# EAGLE design BMW_testboard (EAGLE 6.4)
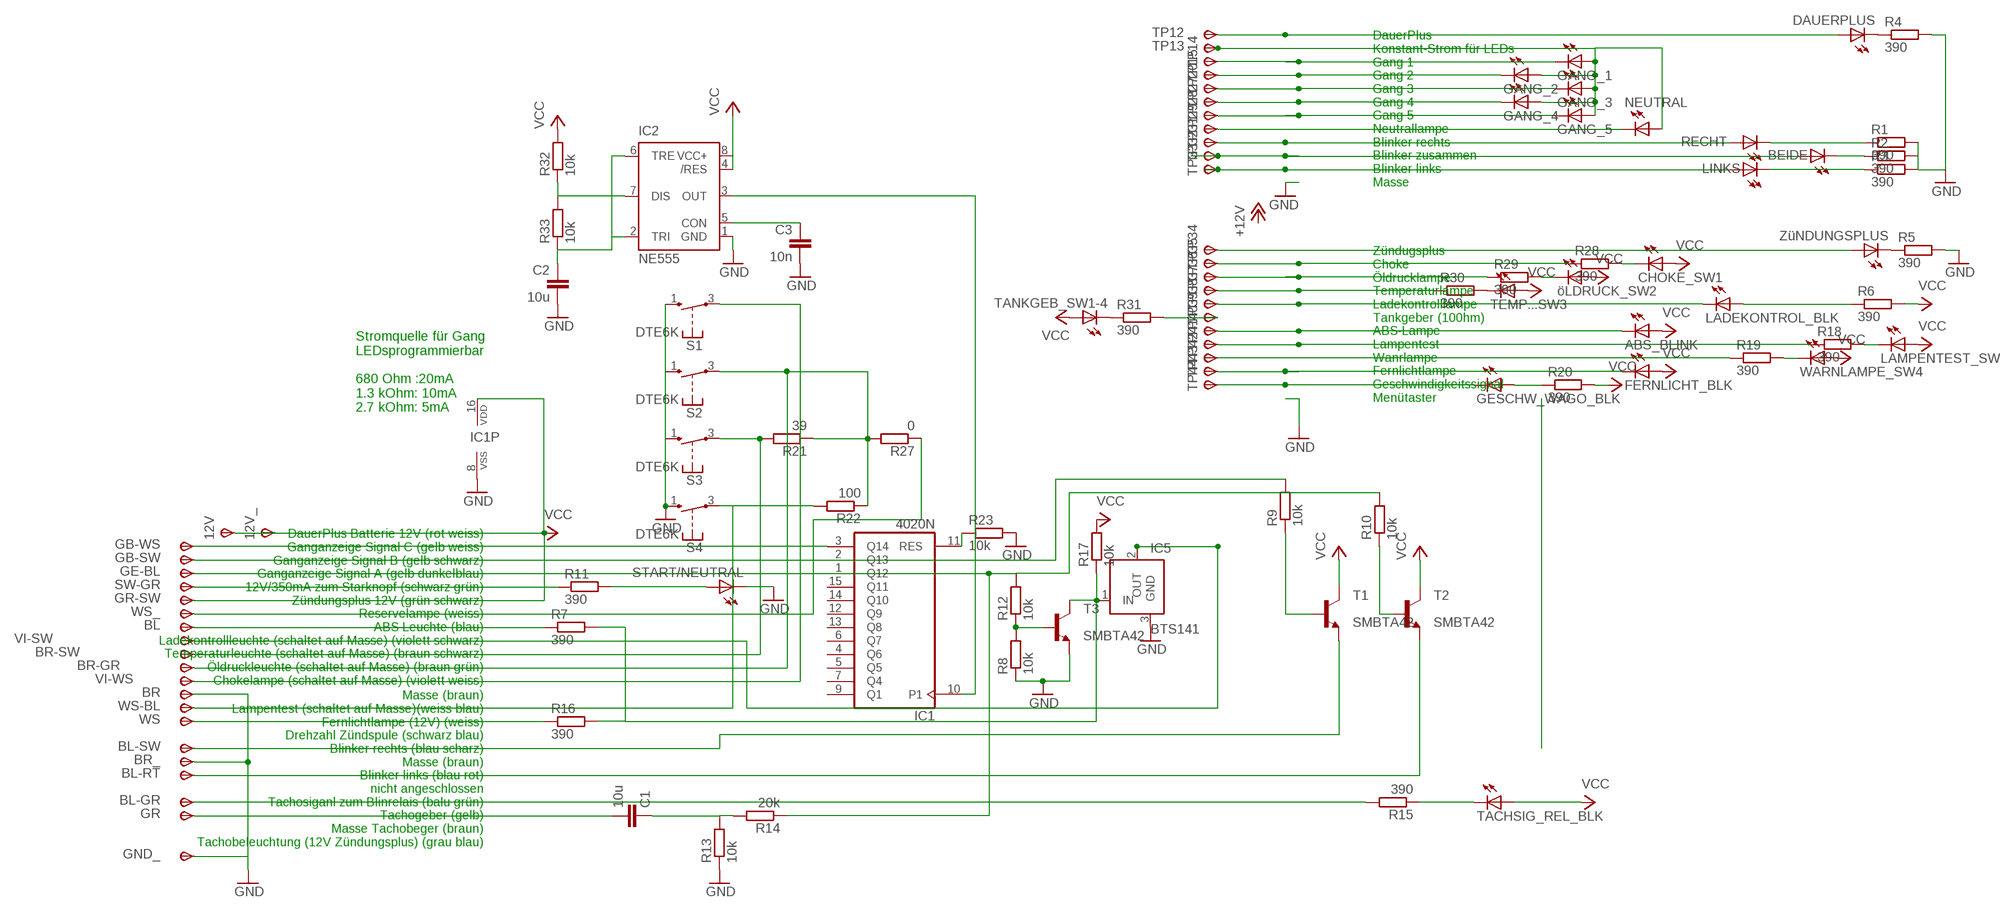
[diagram p0: schematic, sheet 1]

## Parts
12V  TPSPAD1-1.5MM  [P1-13]
12V_  TPSPAD1-1.5MM  [P1-13]
ABS_BLINK  TLLY4400  [LED3MM]
BEIDE  TLLY4400  [LED3MM]
BL  TPSPAD1-1.5MM  [P1-13]
BL-GR  TPSPAD1-1.5MM  [P1-13]
BL-RT  TPSPAD1-1.5MM  [P1-13]
BL-SW  TPSPAD1-1.5MM  [P1-13]
BR  TPSPAD1-1.5MM  [P1-13]
BR-GR  TPSPAD1-1.5MM  [P1-13]
BR-SW  TPSPAD1-1.5MM  [P1-13]
BR_  TPSPAD1-1.5MM  [P1-13]
C1  10u  C-EU025-024X044  [C025-024X044]
C2  10u  C-EU025-024X044  [C025-024X044]
C3  10n  C-EU025-024X044  [C025-024X044]
CHOKE_SW1  TLLY4400  [LED3MM]
DAUERPLUS  TLLY4400  [LED3MM]
FERNLICHT_BLK  TLLY4400  [LED3MM]
GANG_1  TLLY4400  [LED3MM]
GANG_2  TLLY4400  [LED3MM]
GANG_3  TLLY4400  [LED3MM]
GANG_4  TLLY4400  [LED3MM]
GANG_5  TLLY4400  [LED3MM]
GB-SW  TPSPAD1-1.5MM  [P1-13]
GB-WS  TPSPAD1-1.5MM  [P1-13]
GE-BL  TPSPAD1-1.5MM  [P1-13]
GESCHW_WAGO_BLK  TLLY4400  [LED3MM]
GND_  TPSPAD1-1.5MM  [P1-13]
GR  TPSPAD1-1.5MM  [P1-13]
GR-SW  TPSPAD1-1.5MM  [P1-13]
IC1  4020N  [DIL16]
IC2  NE555  [DIL-08]
IC5  BTS141  [TO220-3-45]
LADEKONTROL_BLK  TLLY4400  [LED3MM]
LAMPENTEST_SW4  TLLY4400  [LED3MM]
LINKS  TLLY4400  [LED3MM]
NEUTRAL  TLLY4400  [LED3MM]
R1  390  R-EU_R0805  [R0805]
R2  390  R-EU_R0805  [R0805]
R3  390  R-EU_R0805  [R0805]
R4  390  R-EU_R0805  [R0805]
R5  390  R-EU_R0805  [R0805]
R6  390  R-EU_R0805  [R0805]
R7  390  R-EU_R0805  [R0805]
R8  10k  R-EU_R0805  [R0805]
R9  10k  R-EU_R0805  [R0805]
R10  10k  R-EU_R0805  [R0805]
R11  390  R-EU_R0805  [R0805]
R12  10k  R-EU_R0805  [R0805]
R13  10k  R-EU_0207/12  [0207/12]
R14  20k  R-EU_0207/12  [0207/12]
R15  390  R-EU_R0805  [R0805]
R16  390  R-EU_R0805  [R0805]
R17  10k  R-EU_R0805  [R0805]
R18  390  R-EU_R0805  [R0805]
R19  390  R-EU_R0805  [R0805]
R20  390  R-EU_R0805  [R0805]
R21  39  R-EU_0207/12  [0207/12]
R22  100  R-EU_0207/12  [0207/12]
R23  10k  R-EU_R0805  [R0805]
R27  0  R-EU_0207/12  [0207/12]
R28  390  R-EU_R0805  [R0805]
R29  390  R-EU_R0805  [R0805]
R30  390  R-EU_R0805  [R0805]
R31  390  R-EU_R0805  [R0805]
R32  10k  R-EU_0207/12  [0207/12]
R33  10k  R-EU_0207/15  [0207/15]
RECHT  TLLY4400  [LED3MM]
S1  DTE6K  [DTE6K]
S2  DTE6K  [DTE6K]
S3  DTE6K  [DTE6K]
S4  DTE6K  [DTE6K]
START/NEUTRAL  TLLY4400  [LED3MM]
SW-GR  TPSPAD1-1.5MM  [P1-13]
T1  MMBTA42LT1-NPN-SOT23-BEC  [SOT23-BEC]
T2  MMBTA42LT1-NPN-SOT23-BEC  [SOT23-BEC]
T3  MMBTA42LT1-NPN-SOT23-BEC  [SOT23-BEC]
TACHSIG_REL_BLK  TLLY4400  [LED3MM]
TANKGEB_SW1-4  TLLY4400  [LED3MM]
TEMP...SW3  TLLY4400  [LED3MM]
TP12  TPSPAD1-1.5MM  [P1-13]
TP13  TPSPAD1-1.5MM  [P1-13]
TP14  TPSPAD1-1.5MM  [P1-13]
TP15  TPSPAD1-1.5MM  [P1-13]
TP20  TPSPAD1-1.5MM  [P1-13]
TP27  TPSPAD1-1.5MM  [P1-13]
TP28  TPSPAD1-1.5MM  [P1-13]
TP29  TPSPAD1-1.5MM  [P1-13]
TP31  TPSPAD1-1.5MM  [P1-13]
TP32  TPSPAD1-1.5MM  [P1-13]
TP33  TPSPAD1-1.5MM  [P1-13]
TP34  TPSPAD1-1.5MM  [P1-13]
TP35  TPSPAD1-1.5MM  [P1-13]
TP36  TPSPAD1-1.5MM  [P1-13]
TP37  TPSPAD1-1.5MM  [P1-13]
TP38  TPSPAD1-1.5MM  [P1-13]
TP39  TPSPAD1-1.5MM  [P1-13]
TP40  TPSPAD1-1.5MM  [P1-13]
TP41  TPSPAD1-1.5MM  [P1-13]
TP42  TPSPAD1-1.5MM  [P1-13]
TP43  TPSPAD1-1.5MM  [P1-13]
TP44  TPSPAD1-1.5MM  [P1-13]
VI-SW  TPSPAD1-1.5MM  [P1-13]
VI-WS  TPSPAD1-1.5MM  [P1-13]
WARNLAMPE_SW4  TLLY4400  [LED3MM]
WS  TPSPAD1-1.5MM  [P1-13]
WS-BL  TPSPAD1-1.5MM  [P1-13]
WS_  TPSPAD1-1.5MM  [P1-13]
ZüNDUNGSPLUS  TLLY4400  [LED3MM]
öLDRUCK_SW2  TLLY4400  [LED3MM]

## Nets
GND: BR.TP(PP) BR_.TP(PP) C2.2 C3.2 GND_.TP(PP) IC1.8(VSS) IC2.1(GND) IC5.3(GND) R1.2 R2.2 R3.2 R4.2 R5.2 R8.1 R13.1 R23.2 S1.1(S) S2.1(S) S3.1(S) S4.1(S) START/NEUTRAL.K(C) T3.E
N$1: R19.1 TP42.TP(PP)
N$2: R31.2 TP39.TP(PP)
N$3: GB-WS.TP(PP) IC1.3(Q14)
N$4: ABS_BLINK.K(C) TP40.TP(PP)
N$5: GB-SW.TP(PP) IC1.2(Q13) R9.2
N$7: TP34.TP(PP) ZüNDUNGSPLUS.A
N$8: IC1.11(RES) R23.1
N$12: R30.2 TEMP...SW3.K(C)
N$13: R29.1 TP36.TP(PP)
N$14: R30.1 TP37.TP(PP)
N$15: R19.2 WARNLAMPE_SW4.K(C)
N$18: R11.2 START/NEUTRAL.A
N$19: R18.1 TP41.TP(PP)
N$20: RECHT.A TP31.TP(PP)
N$21: LINKS.A TP33.TP(PP)
N$22: BEIDE.A TP32.TP(PP)
N$23: R11.1 SW-GR.TP(PP)
N$24: LAMPENTEST_SW4.K(C) R18.2
N$25: LADEKONTROL_BLK.A R6.1
N$26: GESCHW_WAGO_BLK.K(C) TP44.TP(PP)
N$27: R1.1 RECHT.K(C)
N$28: BEIDE.K(C) R2.1
N$29: LINKS.K(C) R3.1
N$30: DAUERPLUS.K(C) R4.1
N$31: GESCHW_WAGO_BLK.A R20.1
N$33: DAUERPLUS.A TP12.TP(PP)
N$34: R5.1 ZüNDUNGSPLUS.K(C)
N$35: FERNLICHT_BLK.K(C) TP43.TP(PP)
N$37: BL.TP(PP) R7.1
N$39: IC5.2(OUT) VI-SW.TP(PP)
N$40: R22.2 S4.3(P) WS-BL.TP(PP)
N$41: BR-GR.TP(PP) R21.1 R22.1 R27.2 S2.3(P)
N$42: R9.1 T1.B
N$43: R10.1 T2.B
N$44: BL-SW.TP(PP) T1.E
N$45: BL-RT.TP(PP) T2.E
N$46: R8.2 R12.1 T3.B
N$47: C1.2 GR.TP(PP)
N$48: C1.1 R13.2 R14.2
N$49: GE-BL.TP(PP) IC1.1(Q12) R10.2 R12.2 R14.1
N$50: R15.1 TACHSIG_REL_BLK.K(C)
N$51: BL-GR.TP(PP) R15.2
N$52: NEUTRAL.K(C) TP29.TP(PP)
N$53: R16.1 WS.TP(PP)
N$56: R28.1 TP35.TP(PP)
N$57: IC5.1(IN) R7.2 R16.2 R17.1 T3.C
N$58: BR-SW.TP(PP) R21.2 S3.3(P)
N$59: GANG_1.A GANG_2.A GANG_3.A GANG_4.A GANG_5.A NEUTRAL.A TP13.TP(PP)
N$60: R29.2 öLDRUCK_SW2.K(C)
N$62: CHOKE_SW1.K(C) R28.2
N$63: GANG_5.K(C) TP28.TP(PP)
N$65: R31.1 TANKGEB_SW1-4.K(C)
N$66: C2.1 IC2.2(TRI) IC2.6(TRE) R33.1
N$67: IC1.10(P1) IC2.3(OUT)
N$68: IC2.7(DIS) R32.1 R33.2
N$70: C3.1 IC2.5(CON)
N$93: GANG_3.K(C) TP20.TP(PP)
N$94: GANG_4.K(C) TP27.TP(PP)
N$98: GANG_2.K(C) TP15.TP(PP)
N$99: GANG_1.K(C) TP14.TP(PP)
N$102: LADEKONTROL_BLK.K(C) TP38.TP(PP)
VCC: 12V.TP(PP) 12V_.TP(PP) ABS_BLINK.A CHOKE_SW1.A FERNLICHT_BLK.A GR-SW.TP(PP) IC1.16(VDD) IC2.4(/RES) IC2.8(VCC+) LAMPENTEST_SW4.A R6.2 R17.2 R20.2 R32.2 T1.C T2.C TACHSIG_REL_BLK.A TANKGEB_SW1-4.A TEMP...SW3.A WARNLAMPE_SW4.A öLDRUCK_SW2.A
VI-WS: S1.3(P) VI-WS.TP(PP)
WS: R27.1 WS_.TP(PP)
Unconnected: IC1.4(Q6) IC1.5(Q5) IC1.6(Q7) IC1.7(Q4) IC1.9(Q1) IC1.12(Q9) IC1.13(Q8) IC1.14(Q10) IC1.15(Q11)

## Notes on the sheet
- DauerPlus
  Konstant-Strom für LEDs
  Gang 1
  Gang 2
  Gang 3
  Gang 4
  Gang 5
  Neutrallampe
  Blinker rechts
  Blinker zusammen
  Blinker links
  Masse
- Zündugsplus
  Choke
  Öldrucklampe
  Temperaturlampe
  Ladekontrolllampe
  Tankgeber (100hm)
  ABS-Lampe
  Lampentest
  Wanrlampe
  Fernlichtlampe
  Geschwindigkeitssignal
  Menütaster
- Stromquelle für Gang 
  LEDsprogrammierbar
  
  680 Ohm :20mA
  1.3 kOhm: 10mA
  2.7 kOhm: 5mA
- DauerPlus Batterie 12V (rot weiss)
  Ganganzeige Signal C (gelb weiss)
  Ganganzeige Signal B (gelb schwarz)
  Ganganzeige Signal A (gelb dunkelblau)
  12V/350mA zum Starknopf (schwarz grün)
  Zündungsplus 12V (grün schwarz)
  Reservelampe (weiss)
  ABS Leuchte (blau)
  Ladekontrollleuchte (schaltet auf Masse) (violett schwarz)
  Temperaturleuchte (schaltet auf Masse) (braun schwarz)
  Öldruckleuchte (schaltet auf Masse) (braun grün)
  Chokelampe (schaltet auf Masse) (violett weiss)
- Masse (braun)
  Lampentest (schaltet auf Masse)(weiss blau)
  Fernlichtlampe (12V) (weiss)
  Drehzahl Zündspule (schwarz blau)
  Blinker rechts (blau scharz)
  Masse (braun)
  Blinker links (blau rot)
  nicht angeschlossen
  Tachosiganl zum Blinrelais (balu grün)
  Tachogeber (gelb)
  Masse Tachobeger (braun)
  Tachobeleuchtung (12V Zündungsplus) (grau blau)

## Library data of the parts
12V 12V_ BL BL-GR BL-RT BL-SW BR BR-GR BR-SW BR_ GB-SW GB-WS GE-BL GND_ GR GR-SW SW-GR TP12-TP15 TP20 TP27-TP29 TP31-TP44 VI-SW VI-WS WS WS-BL WS_ = testpin_BMW:TPS: TEST PIN
ABS_BLINK BEIDE CHOKE_SW1 DAUERPLUS FERNLICHT_BLK GANG_1-GANG_5 GESCHW_WAGO_BLK LADEKONTROL_BLK LAMPENTEST_SW4 LINKS NEUTRAL RECHT START/NEUTRAL TACHSIG_REL_BLK TANKGEB_SW1-4 TEMP...SW3 WARNLAMPE_SW4 ZüNDUNGSPLUS öLDRUCK_SW2 = led:TLLY4400: Low Current (2mA) LED 3 mm Tinted Diffused Package color YELLOW Source: Data sheet <http://www.farnell.com/datasheets/391098.pdf>; MF: VISHAY SEMICONDUCTOR; OC_FARNELL: 1612439
C1-C3 = rcl:C-EU: CAPACITOR, European symbol
IC1 = 40xx:4020: 14-stage binary/ripple COUNTER
IC2 = st-microelectronics:NE555: General purpose bipolar Timer; MF: Arrow Electronics; MPN: NE555N; OC_FARNELL: 1467742; OC_NEWARK: 89K1486
IC5 = optosonde_bruker:BTS141: Smart High-Side Power Switch One Channel: 60mOhm Status Feedback Source: Source: www.infineon.com .. BTS428L2_20030912.pdf
R1-R23 R27-R33 = rcl:R-EU_: RESISTOR, European symbol
S1-S4 = switch:DT: ITT SWITCH
T1-T3 = transistor:*-NPN-: NPN Transistror BF959 corrected 2008.03.06; T: SMBTA42

## Board
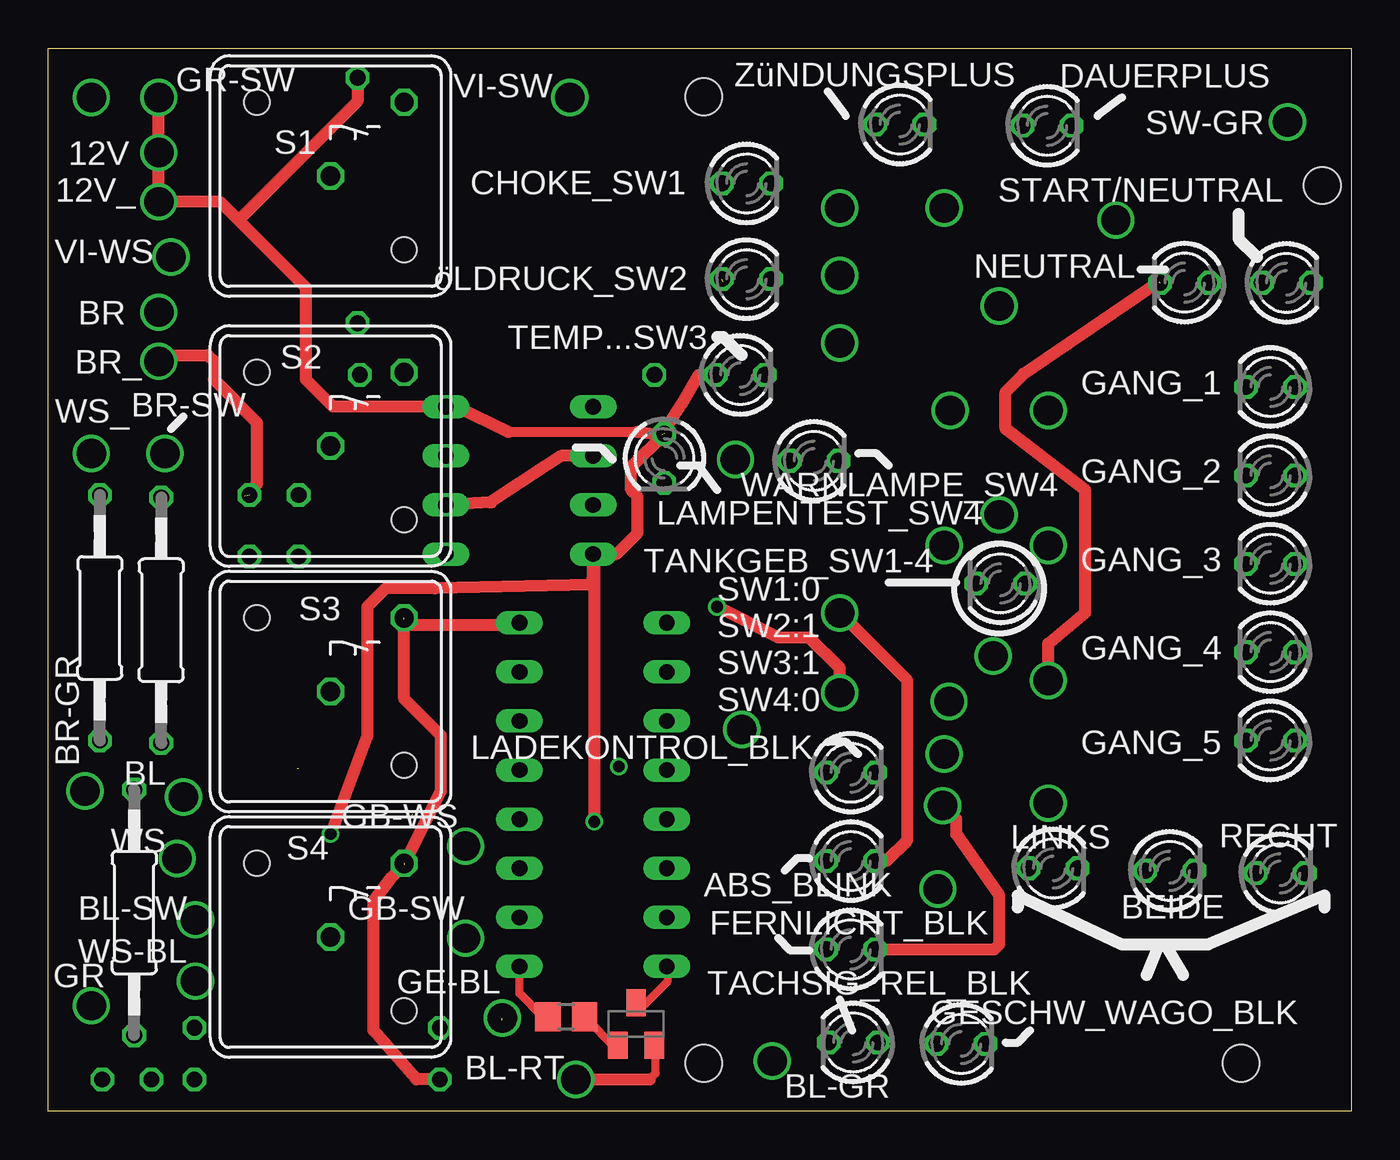
[diagram p1: board, top side]
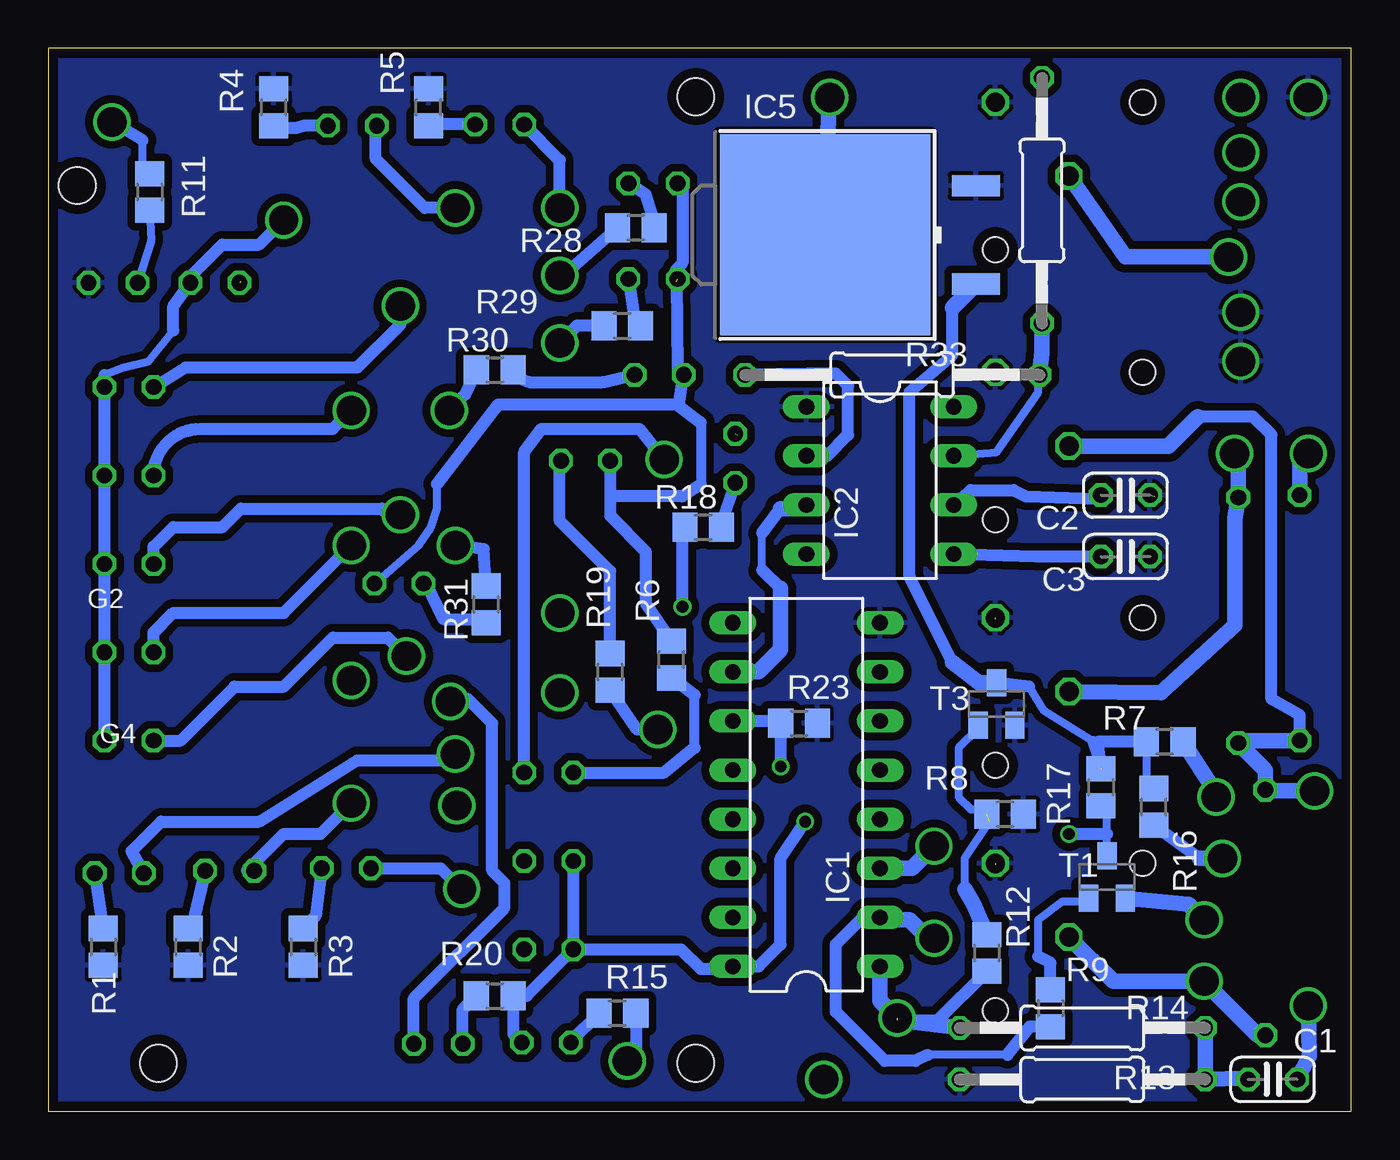
[diagram p2: board, bottom side, seen from below]

Size 67.42 x 55 mm. Coordinates in mm from the lower left corner, seen from the top.
Outline: 0,55 67.42,55 67.42,0 0,0 0,55
Copper layers (1*16): Top 0.035mm / dielectric 1.5mm / Bottom 0.035mm
Design rules "multi-cb_035um-cu *": minimum track width 6mil, minimum drill 12mil, track to track 16mil, track to pad 20mil, pad to pad 16mil, via to via 16mil, smd to smd 16mil, copper to edge 20mil, drill to drill 8mil, minimum pad ring 8mil, minimum via ring 6mil, stop-mask expansion 3mil, vias tented up to drill 0mil, thermal gap 8mil
Holes 1.91 mm at 33.92,2.5 33.92,52.5 61.73,2.5 65.92,47.9

### Footprints (pad centres in the part's own frame; a part is rotated, then mirrored left to right if it is on the bottom)
P1-13 = drill 1.524: TP 0,0
LED3MM = drill 0.813 octagon: A -1.27,0; K 1.27,0
C025-024X044 = drill 0.813 octagon: 1 -1.27,0; 2 1.27,0
DIL16 = drill 0.813 long: 1 -8.89,-3.81; 2 -6.35,-3.81; 3 -3.81,-3.81; 4 -1.27,-3.81; 5 1.27,-3.81; 6 3.81,-3.81; 7 6.35,-3.81; 8 8.89,-3.81; 9 8.89,3.81; 10 6.35,3.81; 11 3.81,3.81; 12 1.27,3.81; 13 -1.27,3.81; 14 -3.81,3.81; 15 -6.35,3.81; 16 -8.89,3.81
DIL-08 = drill 0.813 long: 1 -3.81,-3.81; 2 -1.27,-3.81; 3 1.27,-3.81; 4 3.81,-3.81; 5 3.81,3.81; 6 1.27,3.81; 7 -1.27,3.81; 8 -3.81,3.81
TO220-3-45 = smd 1.1 x 2.5: 1 -2.54,-2.55; 3 2.54,-2.55 | smd 10.4 x 10.9: 2 0,5.25
R0805 = smd 1.3 x 1.5: 1 -0.95,0; 2 0.95,0
0207/12 = drill 0.813 octagon: 1 -6.35,0; 2 6.35,0
0207/15 = drill 0.813 octagon: 1 -7.62,0; 2 7.62,0
DTE6K = drill 1 octagon: 1 -3.81,3.81; 3 0,0 | hole 1.3: 3.81,3.81; -3.81,-3.81
SOT23-BEC = smd 1 x 1.4: B -0.95,-1.1; C 0,1.1; E 0.95,-1.1

### Placement (x,y rotation side)
12V  5.71,49.6 180 top
12V_  5.71,47.06 180 top
ABS_BLINK  41.53,12.96 0 top
BEIDE  58.04,12.46 0 top
BL  6.99,16.27 90 top
BL-GR  37.47,2.61 180 top
BL-RT  27.3,1.66 180 top
BL-SW  7.62,9.91 0 top
BR  5.71,41.35 180 top
BR-GR  1.91,16.58 180 top
BR-SW  6.03,34.05 90 top
BR_  5.71,38.81 180 top
C1  4.06,1.66 0 bottom
C2  11.68,31.89 0 bottom
C3  11.68,28.71 0 bottom
CHOKE_SW1  36.13,48.02 0 top
DAUERPLUS  51.69,51 0 top
FERNLICHT_BLK  41.53,8.39 0 top
GANG_1  63.25,37.47 180 top
GANG_2  63.25,32.9 180 top
GANG_3  63.25,28.33 180 top
GANG_4  63.25,23.76 180 top
GANG_5  63.25,19.19 180 top
GB-SW  21.59,8.96 0 top
GB-WS  21.59,13.72 0 top
GE-BL  23.5,4.83 0 top
GESCHW_WAGO_BLK  47.24,3.5 0 top
GND_  2.22,52.46 0 top
GR  2.22,5.47 0 top
GR-SW  5.71,52.46 180 top
IC1  28.19,16.39 90 bottom
IC2  24.38,32.65 270 bottom
IC5  21.97,45.35 90 bottom
LADEKONTROL_BLK  41.53,17.54 0 top
LAMPENTEST_SW4  31.88,33.79 270 top
LINKS  52.01,12.58 0 top
NEUTRAL  58.8,42.87 180 top
R1  64.58,8.52 270 bottom
R2  60.2,8.52 270 bottom
R3  54.23,8.52 270 bottom
R4  55.75,51.95 90 bottom
R5  47.75,51.95 90 bottom
R6  35.18,23.38 90 bottom
R7  9.65,19.12 180 bottom
R8  17.91,15.38 180 bottom
R9  15.56,5.34 270 bottom
R10  26.8,4.9 180 top
R11  62.17,47.57 270 bottom
R12  18.86,8.2 270 bottom
R13  13.91,1.66 0 bottom
R14  13.91,4.33 0 bottom
R15  37.97,5.09 0 bottom
R16  10.22,15.76 90 bottom
R17  12.95,16.77 270 bottom
R18  33.53,30.23 0 bottom
R19  38.35,22.74 90 bottom
R20  44.32,5.98 0 bottom
R21  5.84,25.41 90 top
R22  4.45,10.3 270 top
R23  28.57,20.07 0 bottom
R27  2.67,25.54 270 top
R28  37.02,45.73 0 bottom
R29  37.72,40.65 0 bottom
R30  44.32,38.36 0 bottom
R31  44.77,26.23 90 bottom
R32  16,47.13 90 bottom
R33  23.75,38.11 0 bottom
RECHT  63.75,12.33 0 top
S1  14.61,48.4 270 top
S2  14.61,34.43 270 top
S3  14.61,21.73 270 top
S4  14.61,9.03 270 top
START/NEUTRAL  64.07,42.87 0 top
SW-GR  64.14,51.19 180 top
T1  12.64,12.14 0 bottom
T2  30.42,4.52 0 top
T3  18.35,21.09 0 bottom
TACHSIG_REL_BLK  41.66,3.56 180 top
TANKGEB_SW1-4  49.28,27.31 180 top
TEMP...SW3  35.81,38.11 0 top
TP12  46.35,46.74 180 bottom
TP13  55.24,46.11 180 bottom
TP14  49.21,41.66 180 bottom
TP15  51.75,36.27 180 bottom
TP20  49.21,30.87 180 bottom
TP27  51.75,29.28 180 bottom
TP28  48.9,23.57 180 bottom
TP29  51.75,22.3 180 bottom
TP31  46.35,18.49 180 bottom
TP32  51.75,15.95 180 bottom
TP33  46.04,11.5 180 bottom
TP34  40.96,46.74 180 bottom
TP35  40.96,43.25 180 bottom
TP36  40.96,39.76 180 bottom
TP37  46.67,36.27 180 bottom
TP38  35.56,33.73 180 bottom
TP39  46.35,29.28 180 bottom
TP40  40.96,25.79 180 bottom
TP41  40.96,21.66 180 bottom
TP42  35.88,19.76 180 bottom
TP43  46.29,15.82 180 bottom
TP44  46.61,21.22 180 bottom
VI-SW  26.99,52.46 180 top
VI-WS  6.35,44.2 90 top
WARNLAMPE_SW4  39.62,33.66 0 top
WS  6.67,13.09 90 top
WS-BL  7.62,6.74 90 top
WS_  2.22,34.05 90 top
ZüNDUNGSPLUS  44.07,51.06 0 top
öLDRUCK_SW2  36.13,43.06 0 top

### Tracks (layer width: path | path; a pad name or v marks a point on that pad's centre or on a via)
GND  (3 unrouted)
  Top 0.61: 20,1.66 19.05,1.66 16.83,4.2 16.83,10.87 17.78,12.14 18.41,12.77 20.32,16.58 20.32,19.44 18.41,21.34 18.41,25.47 18.73,25.16 24.45,25.16 | 5.71,39.12 8.26,39.12 8.57,38.81 8.57,37.85 10.79,35.63 10.79,32.46 10.16,31.82
  pour Bottom: 0,-0.24 67.31,-0.24 67.31,55 0,55
N$1
  Bottom 0.61: TP42.TP 36.95,19.76 R19.1
N$2
  Bottom 0.61: R31.2 44.89,29.09 TP39.TP
N$3
  Bottom 0.813: IC1.3 22.73,12.58 GB-WS.TP
N$4
  Top 0.61: ABS_BLINK.K 43.37,12.96 44.45,14.04 44.45,22.3 TP40.TP
N$5
  Bottom 0.406: 17.78,2.93 21.91,2.93
  Bottom 0.61: R9.2 16.63,4.39 17.78,2.93 | 21.91,2.93 22.54,2.61 24.13,2.61 26.67,5.15 26.67,8.64 25.4,9.91 24.51,9.91 IC1.2
  Bottom 0.813: 21.46,8.84 GB-SW.TP 21.91,8.96 22.86,9.91 24.26,9.91 IC1.2
N$7
  Bottom 0.61: TP34.TP 40.96,49.22 ZüNDUNGSPLUS.A
N$8
  Bottom 0.61: IC1.11 29.65,20.2 R23.1
N$9  (via drill 0.61)
  Bottom 0.61: 29.53,20.39 v29.53,17.85
N$12
  Bottom 0.61: R30.2 42.86,37.85 42.55,37.73 38.73,37.73 TEMP...SW3.K
N$13
  Bottom 0.61: R29.1 40.07,40.65 TP36.TP
N$14
  Bottom 0.61: R30.1 45.85,37.09 TP37.TP
N$15
  Bottom 0.61: R19.2 38.35,27.95 40.96,30.55 40.96,33.6 WARNLAMPE_SW4.K
N$18
  Bottom 0.406: R11.2 62.1,45.03 START/NEUTRAL.A
N$19  (via drill 0.61)
  Top 0.61: TP41.TP 40.96,22.93 39.37,24.52 37.78,24.52 v34.61,26.11
  Bottom 0.61: v34.61,26.11 34.61,30.11 R18.1
N$20
  Bottom 0.61: RECHT.A 63.12,13.47 61.59,14.99 56.52,14.99 51.44,18.17 46.67,18.17 TP31.TP
N$21
  Bottom 0.61: LINKS.A 47.12,12.58 TP33.TP
N$22
  Bottom 0.61: BEIDE.A 57.15,12.46 55.24,14.36 53.34,14.36 TP32.TP
N$23
  Bottom 0.406: R11.1 62.55,48.52 62.55,50.24
  Bottom 0.61: 62.55,50.24 SW-GR.TP
N$24
  Bottom 0.61: LAMPENTEST_SW4.K 32.64,30.3 R18.2
N$25
  Bottom 0.508: 33.97,18.8 33.97,21.54
  Bottom 0.61: LADEKONTROL_BLK.A 35.56,17.54 33.97,18.8 | 33.97,21.54 R6.1
N$26
  Bottom 0.61: GESCHW_WAGO_BLK.K 48.51,5.85 43.81,10.55 43.81,11.82 44.45,12.46 44.45,20.07 45.72,21.34 46.48,21.34 TP44.TP
N$27
  Bottom 0.61: RECHT.K 64.71,10.23 R1.1
N$28
  Bottom 0.61: BEIDE.K 59.94,9.72 R2.1
N$29
  Bottom 0.61: LINKS.K 53.59,10.1 R3.1
N$30
  Bottom 0.61: DAUERPLUS.K 54.17,51 54.61,50.87 55.62,50.87 R4.1
N$31
  Bottom 0.61: GESCHW_WAGO_BLK.A 45.97,5.28 R20.1
N$33
  Bottom 0.61: TP12.TP 47.94,46.74 50.48,49.28 50.48,50.62 DAUERPLUS.A
N$34
  Bottom 0.61: ZüNDUNGSPLUS.K 47.69,51.06 R5.1
N$35
  Top 0.61: FERNLICHT_BLK.K 48.96,8.39 49.21,8.64 49.21,11.19 46.99,14.36 46.99,15.12 TP43.TP
N$37
  Bottom 0.813: BL.TP 6.99,16.45 R7.1
N$39
  Bottom 0.813: VI-SW.TP 27.3,45.43 IC5.2 30.61,48.73
N$40
  Bottom 0.813: R22.2 4.83,3.95 WS-BL.TP 12.32,6.74 S4.3
N$41
  Bottom 0.61: R27.2 2.67,20.52 4.13,21.34 4.13,35 5.08,35.95 7.94,35.95
  Bottom 0.813: BR-GR.TP 4.38,16.58 R22.1 4.45,17.66 R21.1 5.71,19.19 R27.2 | S2.3 9.46,34.43 7.94,35.95
N$42
  Bottom 0.406: 16.19,8.01 16.19,9.91 14.92,10.87 13.42,10.87 T1.B
  Bottom 0.61: R9.1 15.56,7.69 16.19,8.01
N$43
  Top 0.406: T2.B 29.47,3.18 R10.1
N$44
  Bottom 0.813: T1.E 8.43,10.72 BL-SW.TP
N$45
  Top 0.406: 31.11,1.66 31.43,1.98 31.43,3.03 T2.E
  Top 0.61: BL-RT.TP 31.11,1.66
N$46  (1 unrouted)
  Bottom 0.406: 20,11.5 20,13.09 18.73,14.99 | T3.B 19.3,19.82 20.32,18.8 20.32,16.27 19.68,15.63 19.11,15.63 R8.2
  Bottom 0.813: R12.1 19.55,10.74 20,11.5
N$47
  Bottom 0.813: C1.2 2.16,2.87 GR.TP
N$48
  Bottom 0.813: R14.2 R13.2 5.52,1.72 C1.1
N$49  (1 unrouted)
  Top 0.406: R10.2 25.59,4.9 24.38,6.11 IC1.1
  Bottom 0.61: 23.5,4.71 21.4,4.71 R12.2
  Bottom 0.813: IC1.1 24.38,5.72 GE-BL.TP | 23.5,4.71 R14.1
N$50
  Bottom 0.61: TACHSIG_REL_BLK.K 40.39,3.63 R15.1
N$51
  Bottom 0.61: R15.2 37.02,3.05 BL-GR.TP
N$52  (1 unrouted)
  Top 0.61: TP29.TP 51.75,24.2 53.66,25.79 53.66,32.14 49.53,35.31 49.53,37.22 50.48,38.17 57.47,42.94
N$53
  Bottom 0.61: 7.87,13.09 R16.1
  Bottom 0.813: WS.TP 7.87,13.09
N$56
  Bottom 0.61: TP35.TP 40.76,43.25 R28.1
N$57  (1 unrouted)
  Bottom 0.406: 13.34,19.12 15.88,20.71 16.66,21.98 | R7.2 10.6,17.09 R16.2
  Bottom 0.61: 20.64,23.25 22.86,27.7 22.86,37.22 20.64,39.12 20.64,41.59 | R7.2 13.14,19.12 R17.1 | 12.89,17.72 13.34,19.12 | 16.66,21.98 T3.C
  Bottom 0.813: T3.C 19.26,22.19 20.64,23.25 | 20.64,41.59 IC5.1
N$58
  Bottom 0.813: BR-SW.TP 5.84,33.92 R21.2 6.03,30.68 6.03,25.16 9.84,21.66 14.35,21.73 S3.3
N$59
  Bottom 0.406: 64.52,38.11 63.5,38.49 62.23,38.81 60.96,40.4
  Bottom 0.61: GANG_5.A GANG_4.A GANG_3.A GANG_2.A GANG_1.A 64.52,38.11 | 60.96,40.4 60.96,41.66 NEUTRAL.A 60.07,43.19 58.42,44.84 56.52,44.84 TP13.TP
N$60
  Bottom 0.61: öLDRUCK_SW2.K 37.08,40.96 R29.2
N$62
  Bottom 0.61: R28.2 36.2,46.36 36.51,47.44 CHOKE_SW1.K
N$63
  Bottom 0.61: GANG_5.K 60.58,19.19 57.78,21.98 55.24,21.98 52.7,24.52 49.85,24.52 TP28.TP
N$65
  Bottom 0.61: TANKGEB_SW1-4.K 47.88,27.31 46.99,25.47 45.22,25.47 R31.1
N$66
  Top 0.61: IC2.2 26.54,33.92 22.86,31.5 22.92,31.5 IC2.6
  Bottom 0.61: IC2.6 19.68,32.14 17.46,32.14 16.83,31.82 13.14,31.7 C2.1 | IC2.2 27.11,33.92 26.04,35 26.04,37.54 26.67,38.17 28.13,38.17 R33.1
N$67
  Bottom 0.406: 30.48,28.01 30.48,29.92
  Bottom 0.61: 29.53,27.06 30.48,28.01 | 30.48,29.92 29.53,31.19
  Bottom 0.813: IC1.10 30.67,22.74 29.53,23.89 29.53,27.06 | 29.53,31.19 28.32,31.19 IC2.3
N$68
  Bottom 0.406: IC2.7 18.35,34.11 16.19,37.22 16.19,37.85 R33.2
  Bottom 0.813: R32.1 16,39.25 R33.2
N$70
  Bottom 0.61: C3.1 16.32,28.71 IC2.5
N$93
  Bottom 0.61: GANG_3.K 61.98,29.22 60.96,30.23 58.42,30.23 57.47,31.19 50.16,31.19 49.85,30.87 TP20.TP
N$94
  Bottom 0.61: GANG_4.K 61.98,24.77 60.96,25.79 55.24,25.79 TP27.TP
N$98
  Bottom 0.61: GANG_2.K arc90 59.56,35.31 52.7,35.31 TP15.TP
N$99
  Bottom 0.61: GANG_1.K 60.33,38.49 51.44,38.49 49.21,40.71 TP14.TP
N$102
  Bottom 0.61: LADEKONTROL_BLK.K 42.8,34.11 41.91,35.31 36.83,35.31 TP38.TP
VCC  (via drill 0.61)  (2 unrouted)
  Top 0.406: T2.C 30.63,5.3 32.07,6.74 32.07,7.44 IC1.16
  Top 0.508: 23.81,35.16 30.48,35.16
  Top 0.61: 9.84,46.11 13.34,42.62 13.34,37.85 14.73,36.46 IC2.8 21.14,36.46 23.81,35.16 | 9.84,46.11 8.89,47.06 12V_.TP 12V.TP GR-SW.TP | R32.2 16,52.27 9.84,46.11 | 30.48,35.16 31.75,35 32.77,36.59 33.66,38.11 TEMP...SW3.A | IC2.4 28.13,27.25 20,27.06 17.46,27.06 16.51,26.11 16.51,19.44 v14.61,14.36 | v28.26,14.99 28.26,28.65 28,28.65 IC2.4 | IC2.4 29.4,28.84 30.48,29.92 30.48,31.82 30.16,32.14 30.16,33.35 LAMPENTEST_SW4.A
  Bottom 0.406: T1.C 12.64,14.36 12.64,15.19 R17.2 | TANKGEB_SW1-4.A 48.26,29.28 47.62,30.23 47.31,31.19 47.31,32.46
  Bottom 0.508: 33.66,35.63 33.66,32.46
  Bottom 0.61: TACHSIG_REL_BLK.A 43.37,4.01 R20.2 42.67,5.98 FERNLICHT_BLK.A | ABS_BLINK.A FERNLICHT_BLK.A | CHOKE_SW1.A 34.92,48.02 34.61,47.7 34.61,43.89 34.92,43.57 34.92,42.94 34.86,38.43 TEMP...SW3.A 34.8,36.59 34.92,36.59 | 47.31,32.46 44.13,36.59 34.92,36.59 | WARNLAMPE_SW4.A 38.35,31.82 | 38.35,31.82 38.35,30.81 36.51,28.96 36.51,26.3 R6.2 | 34.92,36.59 33.66,35.63 | 33.66,32.46 34.61,31.82 38.35,31.82 | v14.61,14.36 12.64,14.36 | IC1.16 30.67,7.5 29.53,8.64 29.53,13.09 v28.26,14.99 | IC1.16 32.09,7.5 | FERNLICHT_BLK.A 34.67,8.39 33.66,7.38 32.13,7.38 IC1.16
VI-WS
  Bottom 0.813: VI-WS.TP 11.68,44.2 S1.3
WS
  Bottom 0.813: R27.1 2.67,33.6 WS_.TP

### Text on the board
bPlace: G2 | G4
tNames: SW1:0 / SW2:1 / SW3:1 / SW4:0
tStop: flying / brick